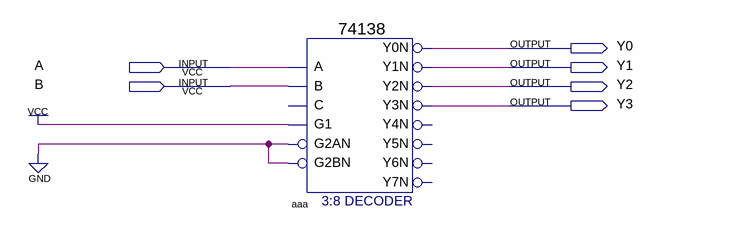
[diagram p0: schematic sheet]
// Quartus schematic 24DECODE.bdf as structural Verilog: 1 symbols, 6 pins
module \24DECODE  (
  input  A,
  input  B,
  output Y0,
  output Y1,
  output Y2,
  output Y3
);

  \74138  aaa (
    .A(A), .B(B), .G1(1'b1), .G2AN(1'b0), .G2BN(1'b0), .Y0N(Y0), .Y1N(Y1), .Y2N(Y2), .Y3N(Y3));  // open: C, Y4N, Y5N, Y6N, Y7N
endmodule
